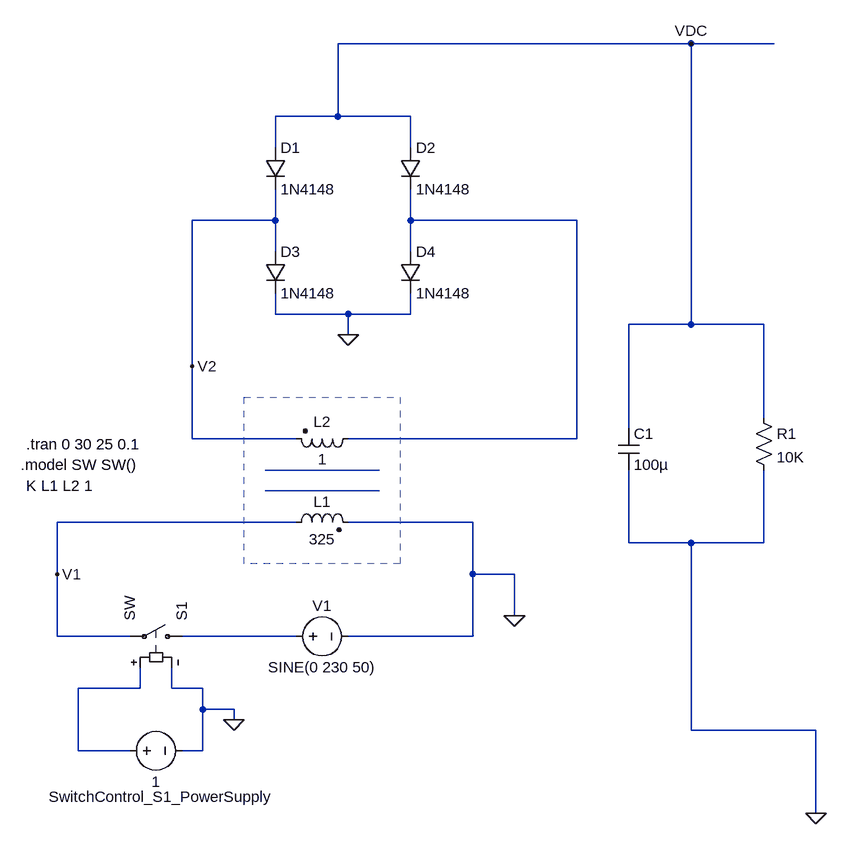
[diagram p0: schematic Aryaman.asc]
Aryaman.asc, the LTspice schematic file:
Version 4
SHEET 1 1076 680
WIRE 864 -768 320 -768
WIRE 992 -768 864 -768
WIRE 320 -656 320 -768
WIRE 320 -656 224 -656
WIRE 432 -656 320 -656
WIRE 224 -608 224 -656
WIRE 432 -608 432 -656
WIRE 224 -496 224 -544
WIRE 224 -496 96 -496
WIRE 432 -496 432 -544
WIRE 688 -496 432 -496
WIRE 224 -448 224 -496
WIRE 432 -448 432 -496
WIRE 224 -352 224 -384
WIRE 336 -352 224 -352
WIRE 432 -352 432 -384
WIRE 432 -352 336 -352
WIRE 864 -336 864 -768
WIRE 864 -336 768 -336
WIRE 976 -336 864 -336
WIRE 336 -320 336 -352
WIRE 96 -272 96 -496
WIRE 976 -192 976 -336
WIRE 768 -176 768 -336
WIRE 96 -160 96 -272
WIRE 256 -160 96 -160
WIRE 688 -160 688 -496
WIRE 688 -160 336 -160
WIRE 256 -32 -112 -32
WIRE 528 -32 336 -32
WIRE 768 0 768 -112
WIRE 864 0 768 0
WIRE 976 0 976 -112
WIRE 976 0 864 0
WIRE -112 48 -112 -32
WIRE 528 48 528 -32
WIRE 592 48 528 48
WIRE 592 112 592 48
WIRE -112 144 -112 48
WIRE 0 144 -112 144
WIRE 256 144 80 144
WIRE 528 144 528 48
WIRE 528 144 336 144
WIRE 16 224 16 192
WIRE 16 224 -80 224
WIRE 64 224 64 192
WIRE 112 224 64 224
WIRE 112 256 112 224
WIRE 160 256 112 256
WIRE 160 272 160 256
WIRE 864 288 864 0
WIRE 1056 288 864 288
WIRE -80 320 -80 224
WIRE 0 320 -80 320
WIRE 112 320 112 256
WIRE 112 320 80 320
WIRE 1056 416 1056 288
FLAG 160 272 0
FLAG 336 -320 0
FLAG -112 48 V1
FLAG 864 -768 VDC
FLAG 592 112 0
FLAG 96 -272 V2
FLAG 1056 416 0
SYMBOL voltage 240 144 R270
WINDOW 0 32 56 VTop 2
WINDOW 3 -32 56 VBottom 2
WINDOW 123 0 0 Left 0
WINDOW 39 0 0 Left 0
SYMATTR InstName V1
SYMATTR Value SINE(0 230 50)
SYMBOL sw 96 144 M270
SYMATTR InstName S1
SYMBOL ind2 240 -16 R270
WINDOW 0 32 56 VTop 2
WINDOW 3 5 56 VBottom 2
SYMATTR InstName L1
SYMATTR Value 325
SYMATTR Type ind
SYMATTR SpiceLine Rser=0.1
SYMBOL ind2 352 -176 R90
WINDOW 0 5 56 VBottom 2
WINDOW 3 32 56 VTop 2
SYMATTR InstName L2
SYMATTR Value 1
SYMATTR Type ind
SYMATTR SpiceLine Rser=0.1
SYMBOL diode 208 -608 R0
SYMATTR InstName D1
SYMATTR Value 1N4148
SYMBOL diode 208 -448 R0
SYMATTR InstName D3
SYMATTR Value 1N4148
SYMBOL diode 416 -608 R0
SYMATTR InstName D2
SYMATTR Value 1N4148
SYMBOL diode 416 -448 R0
SYMATTR InstName D4
SYMATTR Value 1N4148
SYMBOL voltage -16 320 R270
WINDOW 0 -86 64 VTop 2
WINDOW 3 -32 56 VBottom 2
SYMATTR InstName SwitchControl_S1_PowerSupply
SYMATTR Value 1
SYMBOL res 960 -208 R0
SYMATTR InstName R1
SYMATTR Value 10K
SYMBOL cap 752 -176 R0
SYMATTR InstName C1
SYMATTR Value 100µ
TEXT -168 -120 Left 2 !.model SW SW()
TEXT -160 -88 Left 2 !K L1 L2 1
TEXT -160 -152 Left 2 !.tran 0 30 25 0.1
LINE Normal 384 -112 208 -112
LINE Normal 384 -80 208 -80
RECTANGLE Normal 416 32 176 -224 2

The netlist it stands for:
* Aryaman.asc
V1 N002 0 SINE(0 230 50)
S1 N002 V1 N003 0 SW
L1 V1 0 325 Rser=0.1
L2 N001 V2 1 Rser=0.1
D1 VDC V2 1N4148
D3 V2 0 1N4148
D2 VDC N001 1N4148
D4 N001 0 1N4148
V§SwitchControl_S1_PowerSupply N003 0 1
R1 VDC 0 10K
C1 VDC 0 100µ
.model D D
.lib standard.dio
.model SW SW()
K L1 L2 1
.tran 0 30 25 0.1
.backanno
.end

* Results of the author's LTspice run, read from the files saved beside the schematic
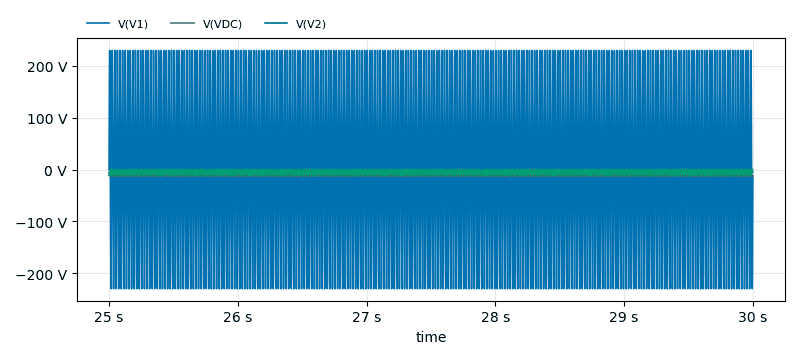
[diagram p1: Transient Analysis of Aryaman.asc, plotted from the saved traces]
* Transient Analysis, 1 run:
*   V(V1): min -229.9 V, max 229.9 V, average 5.198 mV, rms 163.1 V, last 2.28 mV
*   V(VDC): min -11.36 V, max -11.27 V, average -11.32 V, rms 11.32 V, last -11.31 V
*   V(V2): min -12.04 V, max 716.3 mV, average -5.658 V, rms 7.243 V, last -5.657 V